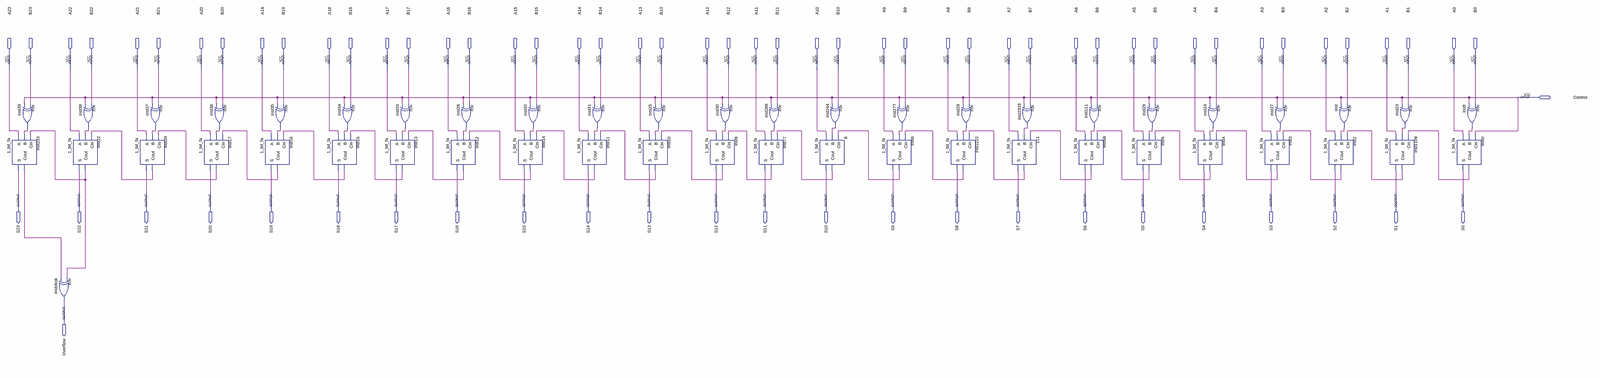
[diagram p0: schematic sheet, whole]
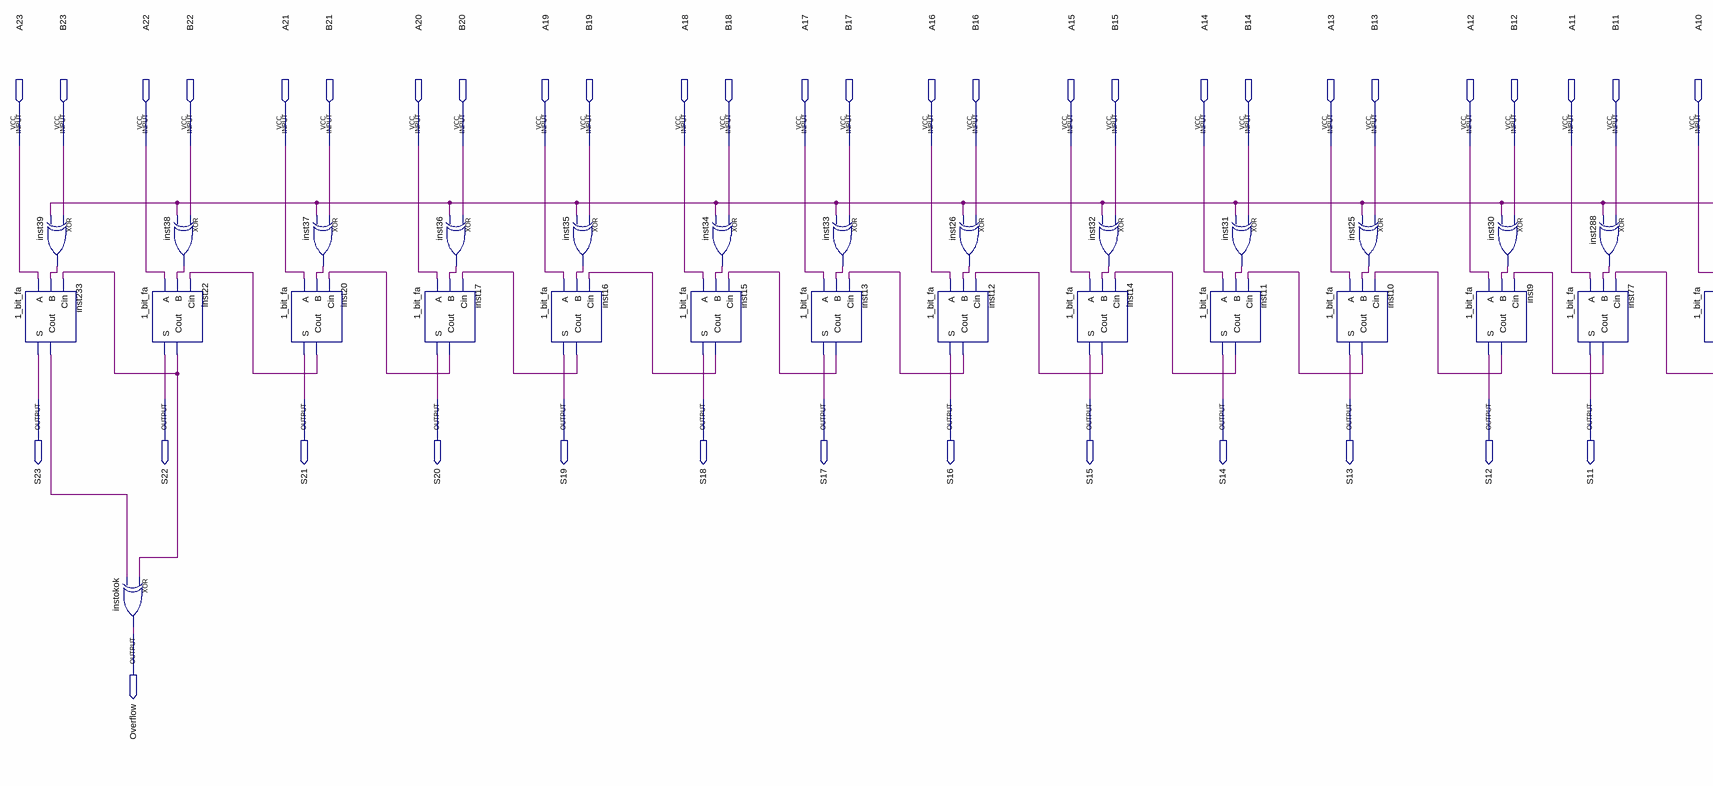
[diagram p1: schematic sheet, left part]
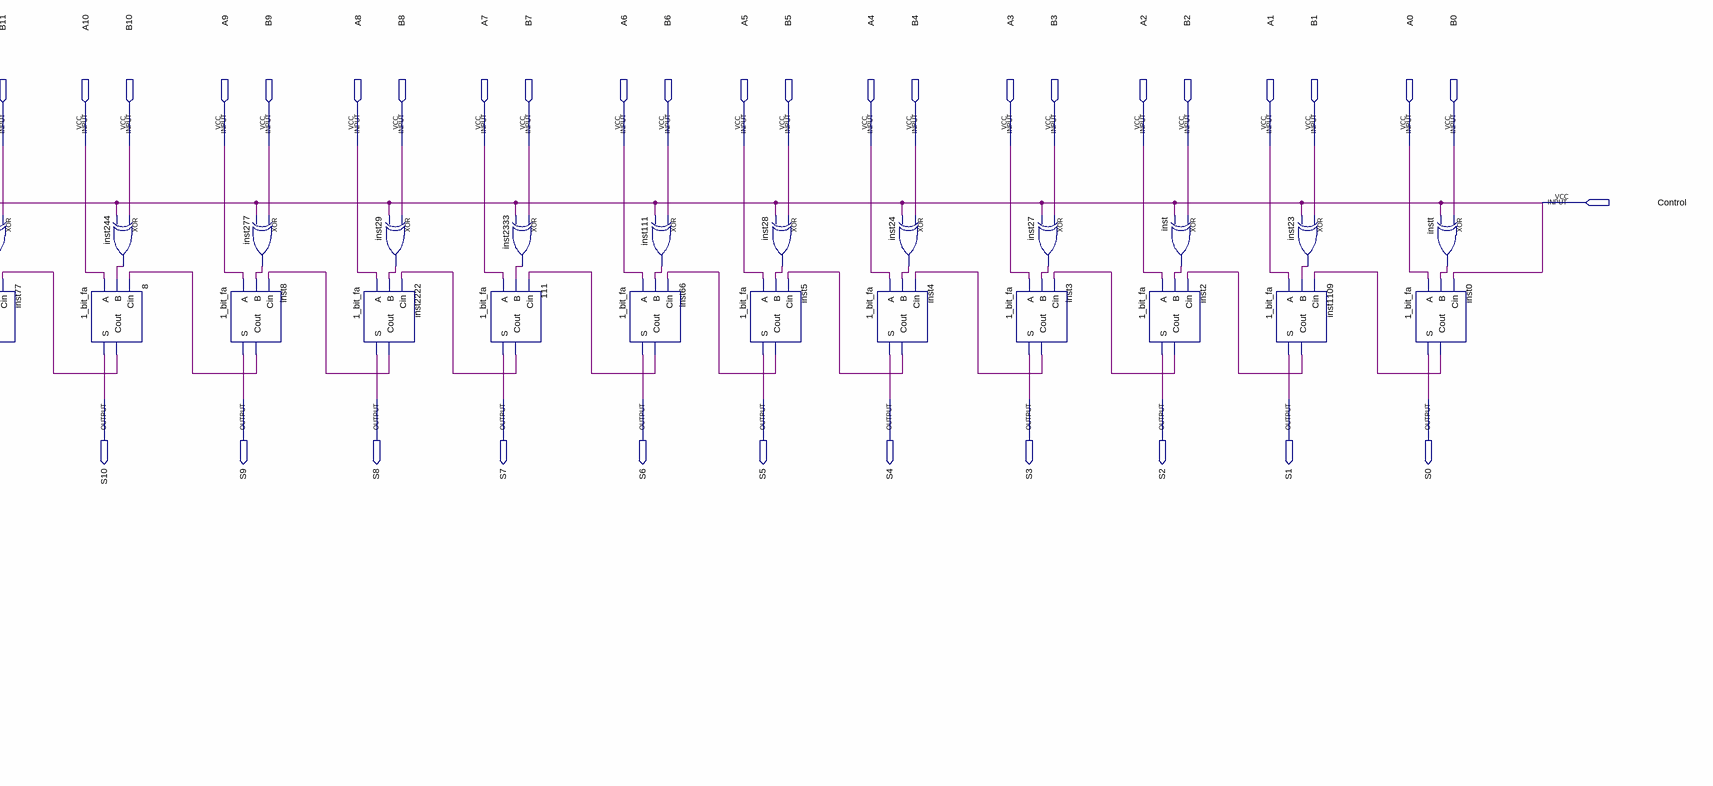
[diagram p2: schematic sheet, right part]
// Quartus schematic 24_bit_add_sub.bdf as structural Verilog: 49 symbols, 74 pins
module \24_bit_add_sub  (
  input  A23,
  input  B23,
  input  A22,
  input  B22,
  input  A21,
  input  B21,
  input  A20,
  input  B20,
  input  A19,
  input  B19,
  input  A18,
  input  B18,
  input  A17,
  input  B17,
  input  A16,
  input  B16,
  input  A15,
  input  B15,
  input  A14,
  input  B14,
  input  A13,
  input  B13,
  input  A12,
  input  B12,
  input  A11,
  input  B11,
  input  A10,
  input  B10,
  input  A9,
  input  B9,
  input  A8,
  input  B8,
  input  A7,
  input  B7,
  input  A6,
  input  B6,
  input  A5,
  input  B5,
  input  A4,
  input  B4,
  input  A3,
  input  B3,
  input  A2,
  input  B2,
  input  A1,
  input  B1,
  input  A0,
  input  B0,
  input  Control,
  output S23,
  output S22,
  output S21,
  output S20,
  output S19,
  output S18,
  output S17,
  output S16,
  output S15,
  output S14,
  output S13,
  output S12,
  output S11,
  output S10,
  output S9,
  output S8,
  output S7,
  output S6,
  output S5,
  output S4,
  output S3,
  output S2,
  output S1,
  output S0,
  output Overflow
);

  wire inst0_cout, inst2_cout, inst3_cout, inst4_cout, inst5_cout, inst8_cout, inst9_cout, inst10_cout,
       inst11_cout, inst12_cout, inst13_cout, inst14_cout, inst15_cout, inst16_cout, inst17_cout,
       inst20_cout, inst22_cout, inst23_out, inst24_out, inst25_out, inst26_out, inst27_out, inst28_out,
       inst29_out, inst30_out, inst31_out, inst32_out, inst33_out, inst34_out, inst35_out, inst36_out,
       inst37_out, inst38_out, inst39_out, inst66_cout, inst77_cout, inst111_out, inst233_cout, inst244_out,
       inst277_out, inst288_out, inst1109_cout, inst2222_cout, inst2333_out, inst_out, instt_out, n8_cout,
       n111_cout;

  xor inst39 (inst39_out, B23, Control);
  \1_bit_fa  inst233 (.A(A23), .B(inst39_out), .Cin(inst22_cout), .S(S23), .Cout(inst233_cout));
  \1_bit_fa  inst22 (.A(A22), .B(inst38_out), .Cin(inst20_cout), .S(S22), .Cout(inst22_cout));
  xor instokok (Overflow, inst22_cout, inst233_cout);
  xor inst38 (inst38_out, B22, Control);
  \1_bit_fa  inst20 (.A(A21), .B(inst37_out), .Cin(inst17_cout), .S(S21), .Cout(inst20_cout));
  xor inst37 (inst37_out, B21, Control);
  xor inst36 (inst36_out, B20, Control);
  \1_bit_fa  inst17 (.A(A20), .B(inst36_out), .Cin(inst16_cout), .S(S20), .Cout(inst17_cout));
  \1_bit_fa  inst16 (.A(A19), .B(inst35_out), .Cin(inst15_cout), .S(S19), .Cout(inst16_cout));
  xor inst35 (inst35_out, B19, Control);
  \1_bit_fa  inst15 (.A(A18), .B(inst34_out), .Cin(inst13_cout), .S(S18), .Cout(inst15_cout));
  xor inst34 (inst34_out, B18, Control);
  \1_bit_fa  inst13 (.A(A17), .B(inst33_out), .Cin(inst12_cout), .S(S17), .Cout(inst13_cout));
  xor inst33 (inst33_out, B17, Control);
  xor inst26 (inst26_out, B16, Control);
  \1_bit_fa  inst12 (.A(A16), .B(inst26_out), .Cin(inst14_cout), .S(S16), .Cout(inst12_cout));
  xor inst32 (inst32_out, B15, Control);
  \1_bit_fa  inst14 (.A(A15), .B(inst32_out), .Cin(inst11_cout), .S(S15), .Cout(inst14_cout));
  \1_bit_fa  inst11 (.A(A14), .B(inst31_out), .Cin(inst10_cout), .S(S14), .Cout(inst11_cout));
  xor inst31 (inst31_out, B14, Control);
  xor inst25 (inst25_out, B13, Control);
  \1_bit_fa  inst10 (.A(A13), .B(inst25_out), .Cin(inst9_cout), .S(S13), .Cout(inst10_cout));
  xor inst30 (inst30_out, B12, Control);
  \1_bit_fa  inst9 (.A(A12), .B(inst30_out), .Cin(inst77_cout), .S(S12), .Cout(inst9_cout));
  xor inst288 (inst288_out, B11, Control);
  \1_bit_fa  inst77 (.A(A11), .B(inst288_out), .Cin(n8_cout), .S(S11), .Cout(inst77_cout));
  \1_bit_fa  u_8 (.A(A10), .B(inst244_out), .Cin(inst8_cout), .S(S10), .Cout(n8_cout));
  xor inst244 (inst244_out, B10, Control);
  xor inst277 (inst277_out, B9, Control);
  \1_bit_fa  inst8 (.A(A9), .B(inst277_out), .Cin(inst2222_cout), .S(S9), .Cout(inst8_cout));
  \1_bit_fa  inst2222 (.A(A8), .B(inst29_out), .Cin(n111_cout), .S(S8), .Cout(inst2222_cout));
  xor inst29 (inst29_out, B8, Control);
  xor inst2333 (inst2333_out, B7, Control);
  \1_bit_fa  u_111 (.A(A7), .B(inst2333_out), .Cin(inst66_cout), .S(S7), .Cout(n111_cout));
  xor inst111 (inst111_out, B6, Control);
  \1_bit_fa  inst66 (.A(A6), .B(inst111_out), .Cin(inst5_cout), .S(S6), .Cout(inst66_cout));
  \1_bit_fa  inst5 (.A(A5), .B(inst28_out), .Cin(inst4_cout), .S(S5), .Cout(inst5_cout));
  xor inst28 (inst28_out, B5, Control);
  xor inst24 (inst24_out, B4, Control);
  \1_bit_fa  inst4 (.A(A4), .B(inst24_out), .Cin(inst3_cout), .S(S4), .Cout(inst4_cout));
  \1_bit_fa  inst3 (.A(A3), .B(inst27_out), .Cin(inst2_cout), .S(S3), .Cout(inst3_cout));
  xor inst27 (inst27_out, B3, Control);
  xor inst (inst_out, B2, Control);
  \1_bit_fa  inst2 (.A(A2), .B(inst_out), .Cin(inst1109_cout), .S(S2), .Cout(inst2_cout));
  \1_bit_fa  inst1109 (.A(A1), .B(inst23_out), .Cin(inst0_cout), .S(S1), .Cout(inst1109_cout));
  xor inst23 (inst23_out, B1, Control);
  \1_bit_fa  inst0 (.A(A0), .B(instt_out), .Cin(Control), .S(S0), .Cout(inst0_cout));
  xor instt (instt_out, B0, Control);
endmodule
